# EAGLE design Regulator (EAGLE 9.6.2)
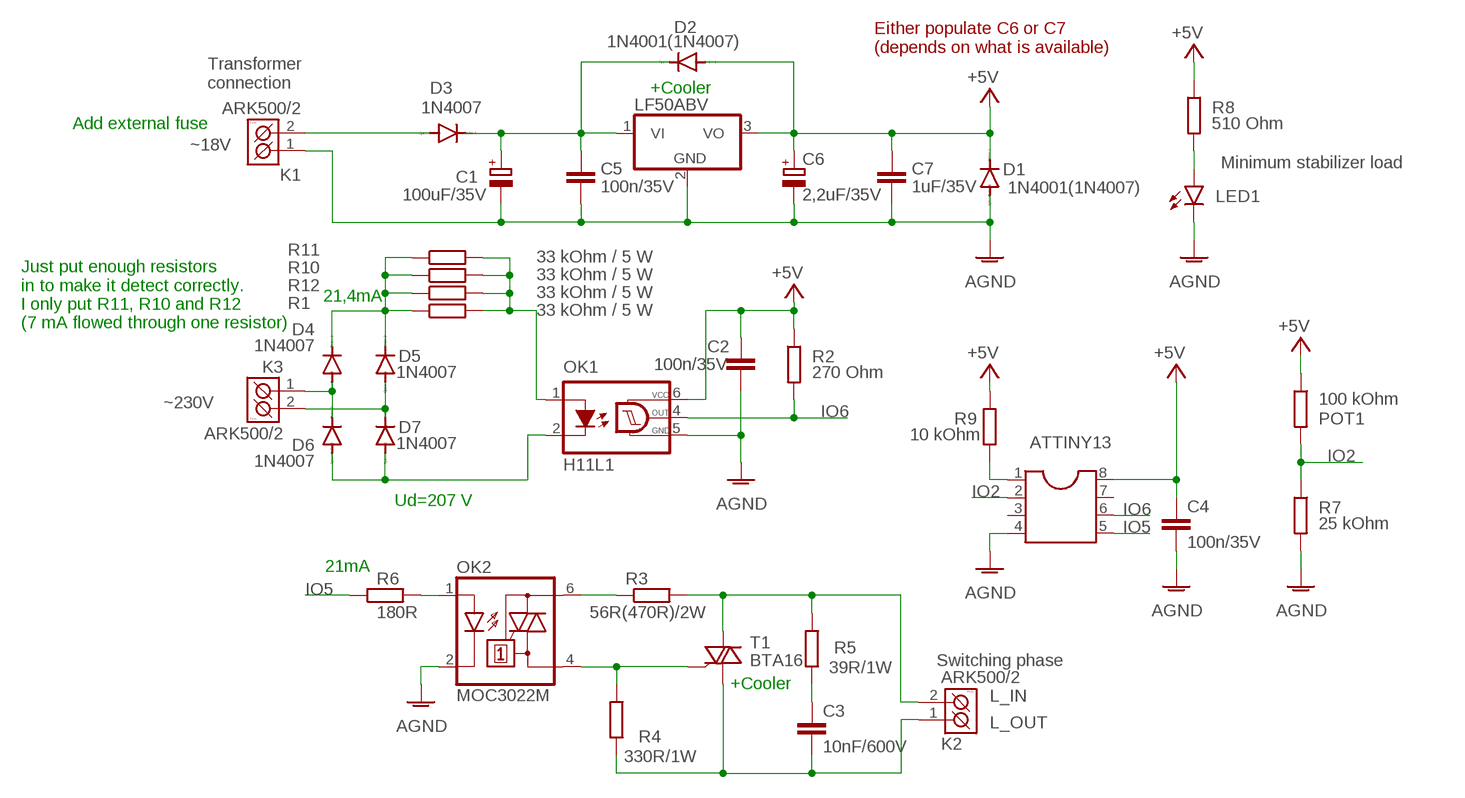
[diagram p0: schematic, sheet 1]

## Parts
ATTINY13  DIL8S  [SOCKET-08]
C1  100uF/35V  CPOL-EUE3.5-8  [E3,5-8]
C2  100n/35V  C-EU050-025X075  [C050-025X075]
C3  10nF/600V  C-EU025-030X050  [C025-030X050]
C4  100n/35V  C-EU050-025X075  [C050-025X075]
C5  100n/35V  C-EU050-025X075  [C050-025X075]
C6  2,2uF/35V  CPOL-EUE2-4  [E2-4]
C7  1uF/35V  C-EU050-025X075  [C050-025X075]
D1  1N4001(1N4007)  DIODE-DO41-7.6  [DO41-7.6]
D2  1N4001(1N4007)  DIODE-DO41-7.6  [DO41-7.6]
D3  1N4007  DIODE-DO41-7.6  [DO41-7.6]
D4  1N4007  DIODE-DO41-7.6  [DO41-7.6]
D5  1N4007  DIODE-DO41-7.6  [DO41-7.6]
D6  1N4007  DIODE-DO41-7.6  [DO41-7.6]
D7  1N4007  DIODE-DO41-7.6  [DO41-7.6]
K1  ARK500/2  [ARK500/2]
K2  ARK500/2  [ARK500/2]
K3  ARK500/2  [ARK500/2]
LED1  LED5MM  [LED5MM]
OK1  H11L1  H11L1M  [DIL06]
OK2  MOC3022M  [DIL06]
POT1  100 kOhm  R-EU_0207/10  [0207/10]
R1  33 kOhm / 5 W  R-EU_0617/5V  [0617V]
R2  270 Ohm  R-EU_0207/10  [0207/10]
R3  56R(470R)/2W  R-EU_0411/15  [0411/15]
R4  330R/1W  R-EU_0411/15  [0411/15]
R5  39R/1W  R-EU_0411/15  [0411/15]
R6  180R  R-EU_0207/10  [0207/10]
R7  25 kOhm  R-EU_0207/10  [0207/10]
R8  510 Ohm  R-EU_0207/10  [0207/10]
R9  10 kOhm  R-EU_0207/10  [0207/10]
R10  33 kOhm / 5 W  R-EU_0617/5V  [0617V]
R11  33 kOhm / 5 W  R-EU_0617/5V  [0617V]
R12  33 kOhm / 5 W  R-EU_0617/5V  [0617V]
ST1  LF50ABV  7805TV  [TO220V]
T1  BTA16  BT138-V  [TO220BV]

## Nets
+5V: ATTINY13.8 C2.1 C4.1 C6.+ C7.1 D1.C D2.A OK1.6(VCC) POT1.1 R2.1 R8.1 R9.1 ST1.3(VO)
AGND: ATTINY13.4 C1.- C2.2 C4.2 C5.2 C6.- C7.2 D1.A K1.1(K1) LED1.K(C) OK1.5(GND) OK2.2(C) R7.2 ST1.2(GND)
IO2: ATTINY13.2 POT1.2 R7.1
IO5: ATTINY13.5 R6.1
IO6: ATTINY13.6 OK1.4(OUT) R2.2
L_IN: K2.2(K2) R3.2 R5.2 T1.T2(A2)
L_OUT: C3.2 K2.1(K1) R4.1 T1.T1(A1)
N$1: OK1.1(A) R1.2 R10.2 R11.2 R12.2
N$2: D4.A D6.C K3.1(K1)
N$3: LED1.A R8.2
N$4: D3.A K1.2(K2)
N$5: OK2.6(A2) R3.1
N$6: D6.A D7.A OK1.2(C)
N$7: D5.A D7.C K3.2(K2)
N$8: C1.+ C5.1 D2.C D3.C ST1.1(VI)
N$9: OK2.1(A) R6.2
N$10: C3.1 R5.1
N$11: OK2.4(A1) R4.2 T1.G
N$12: ATTINY13.1 R9.2
N$14: D4.C D5.C R1.1 R10.1 R11.1 R12.1
Unconnected: ATTINY13.3 ATTINY13.7

## Notes on the sheet
- Either populate C6 or C7
  (depends on what is available)
- Transformer 
  connection
- +Cooler
- Add external fuse
- ~18V
- Minimum stabilizer load
- 21,4mA
- Just put enough resistors 
  in to make it detect correctly. 
  I only put R11, R10 and R12
  (7 mA flowed through one resistor)
- ~230V
- Ud=207 V
- 21mA
- Switching phase
- +Cooler
- L_IN
- L_OUT

## Library data of the parts
ATTINY13 = ic-package:DIL8: Dual In Line / Socket
C1 C6 = rcl:CPOL-EU: POLARIZED CAPACITOR, European symbol; SPICEPREFIX: C
C2-C5 C7 = rcl:C-EU: CAPACITOR, European symbol; SPICEPREFIX: C
D1-D7 = diode:DIODE-: DIODE
K1-K3 = #PaJa_konektory:ARK500/2: Svorkovnice - roztec 5mm - dvojita
LED1 = led:LED: LED OSRAM: - CHIPLED LG R971, LG N971, LY N971, LG Q971, LY Q971, LO R971, LY R971 LH N974, LH R974 LS Q976, LO Q976, LY Q976 LO Q996 - Hyper CHIPLED LW Q18S LB Q993, LB Q99A, LB R99A - SideLED LS A670, LO A670, LY A670, LG A670, LP A670 LB A673, LV A673, LT A673, LW A673 LH A674 LY A675 LS A676, LA A676, LO A676, LY A676, LW A676 LS A679, LY A679, LG A679 - Hyper Micro SIDELED® LS Y876, LA Y876, LO Y876, LY Y876 LT Y87S - SmartLED LW L88C, LW L88S LB L89C, LB L89S, LG L890 LS L89K, LO L89K, LY L89K LS L896, LA L896, LO L896, LY L896 - TOPLED LS T670, LO T670, LY T670, LG T670, LP T670 LSG T670, LSP T670, LSY T670, LOP T670, LYG T670 LG T671, LOG T671, LSG T671 LB T673, LV T673, LT T673, LW T673 LH T674 LS T676, LA T676, LO T676, LY T676, LB T676, LH T676, LSB T676, LW T676 LB T67C, LV T67C, LT T67C, LS T67K, LO T67K, LY T67K, LW E67C LS E67B, LA E67B, LO E67B, LY E67B, LB E67C, LV E67C, LT E67C LW T67C LS T679, LY T679, LG T679 LS T770, LO T770, LY T770, LG T770, LP T770 LB T773, LV T773, LT T773, LW T773 LH T774 LS E675, LA E675, LY E675, LS T675 LS T776, LA T776, LO T776, LY T776, LB T776 LHGB T686 LT T68C, LB T68C - Hyper Mini TOPLED® LB M676 - Mini TOPLED Santana® LG M470 LS M47K, LO M47K, LY M47K Source: http://www.osram.convergy.de LUXEON: - LUMILED® LXK2-PW12-R00, LXK2-PW12-S00, LXK2-PW14-U00, LXK2-PW14-V00 LXK2-PM12-R00, LXK2-PM12-S00, LXK2-PM14-U00 LXK2-PE12-Q00, LXK2-PE12-R00, LXK2-PE12-S00, LXK2-PE14-T00, LXK2-PE14-U00 LXK2-PB12-K00, LXK2-PB12-L00, LXK2-PB12-M00, LXK2-PB14-N00, LXK2-PB14-P00, LXK2-PB14-Q00 LXK2-PR12-L00, LXK2-PR12-M00, LXK2-PR14-Q00, LXK2-PR14-R00 LXK2-PD12-Q00, LXK2-PD12-R00, LXK2-PD12-S00 LXK2-PH12-R00, LXK2-PH12-S00 LXK2-PL12-P00, LXK2-PL12-Q00, LXK2-PL12-R00 Source: www.luxeon.com KINGBRIGHT: KA-3528ASYC Source: www.kingbright.com
OK1 = optocoupler:H11L*M: 6-Pin DIP Optocoupler Source: http://www.fairchildsemi.com/ds/H1/H11L2-M.pdf; MF: FAIRCHILD SEMICONDUCTOR; MPN: H11L1-M; OC_FARNELL: 1021127; OC_NEWARK: 72K8643
OK2 = optocoupler:MOC30*M: RANDOM-PHASE OPTOISOLATORS TRIAC DRIVER OUTPUT Source: http://www.fairchildsemi.com MOC3020-M.pdf; MF: FAIRCHILD SEMICONDUCTOR; MPN: MOC3022-M; OC_FARNELL: 1021086; OC_NEWARK: 58K1956
POT1 R1-R12 = rcl:R-EU_: RESISTOR, European symbol; SPICEPREFIX: R
ST1 = linear:78*: Positive VOLTAGE REGULATOR Source: http://cache.national.com/ds/LM/LM78L05.pdf http://www.fairchildsemi.com/ds/LM/LM7805.pdf
T1 = triac:BT138: TRIAC Source: http://www.semiconductors.philips.com BT138_SERIES_2.pdf

## Board
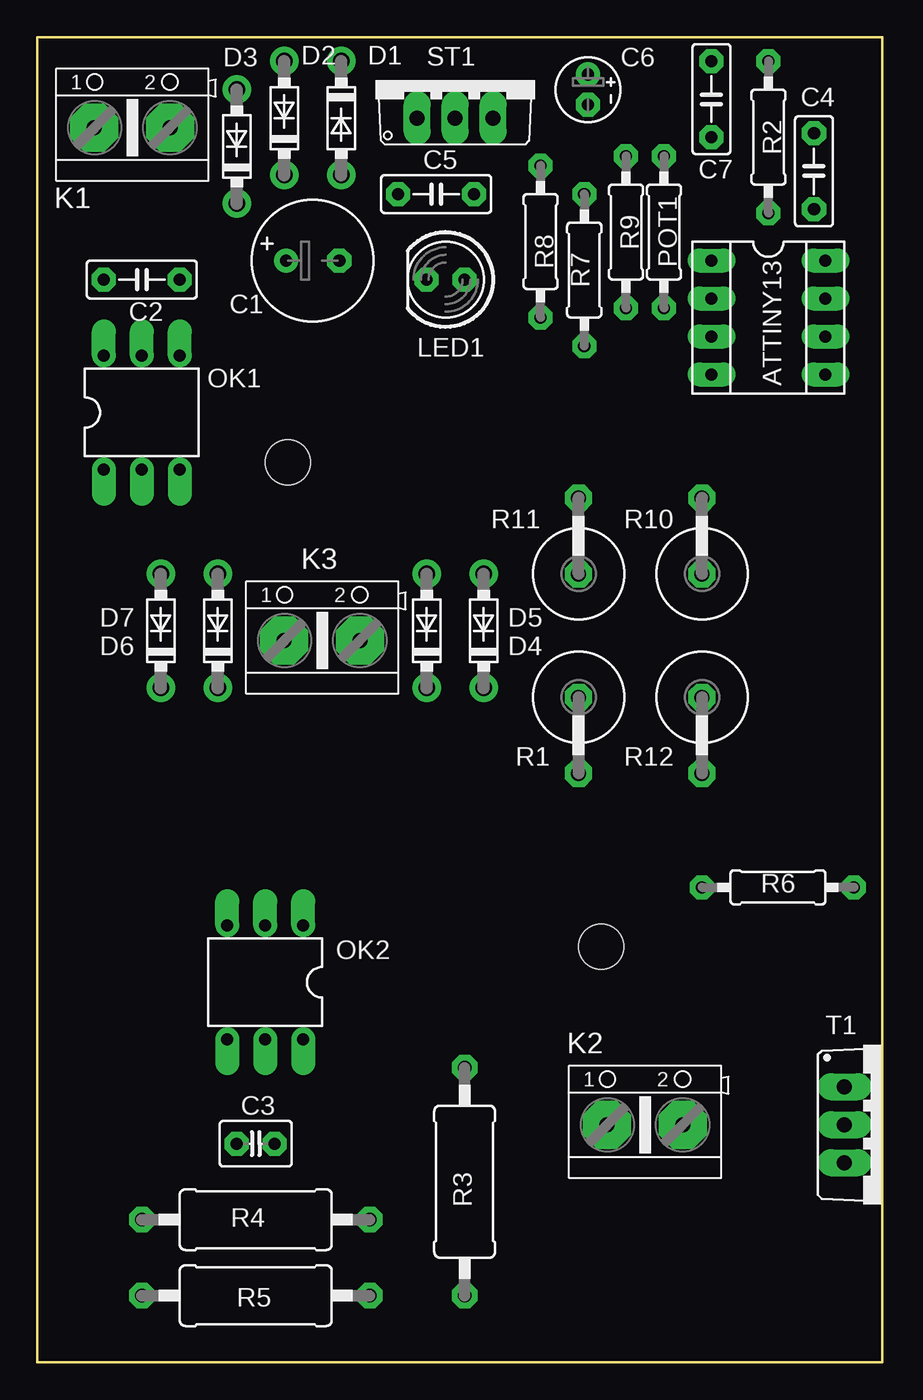
[diagram p1: board, top side]
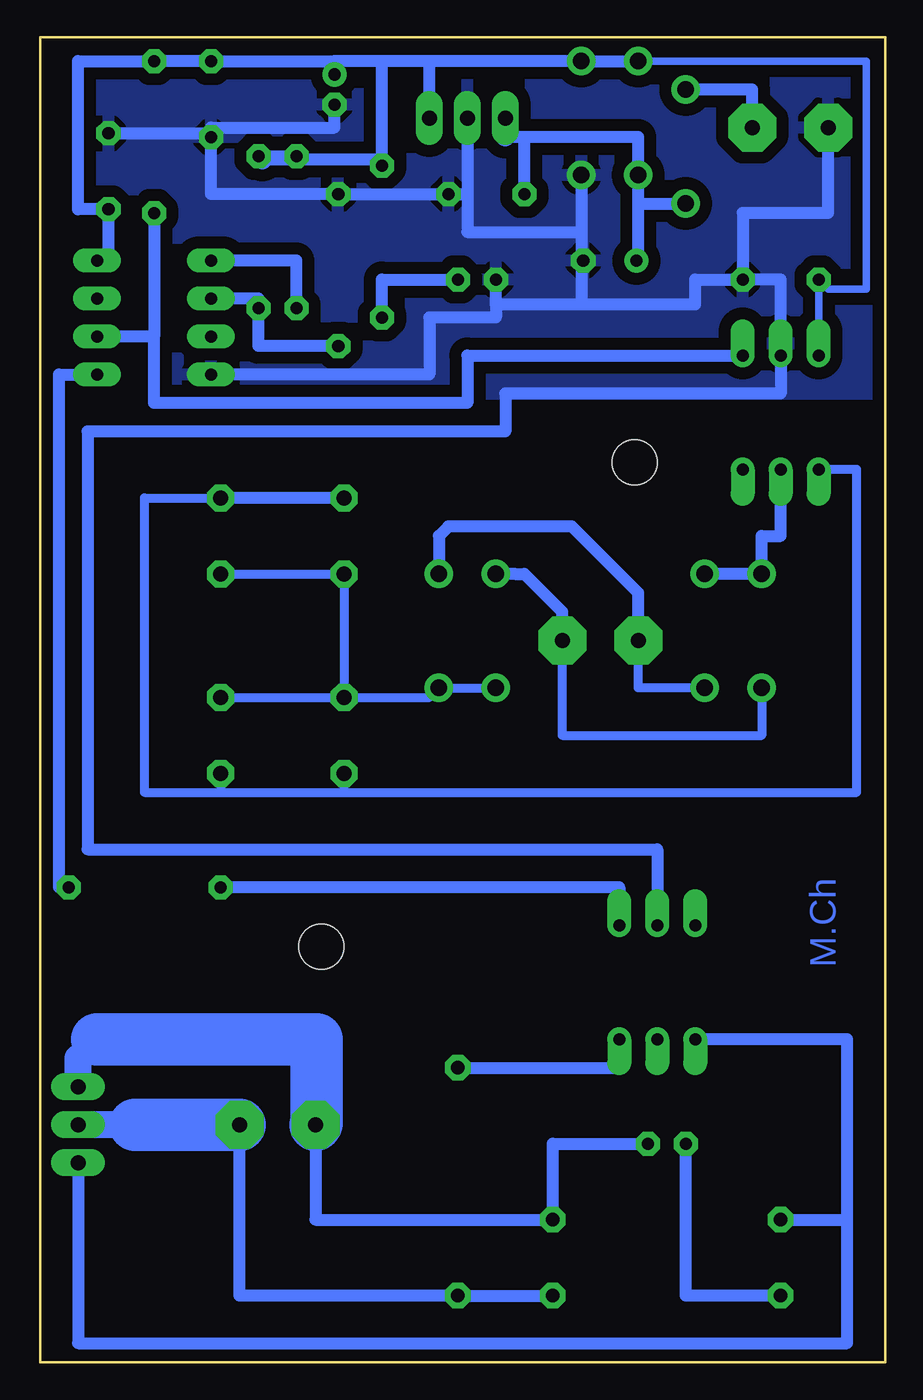
[diagram p2: board, bottom side, seen from below]

Size 56.52 x 88.58 mm. Coordinates in mm from the lower left corner, seen from the top.
Outline: 0,0 56.52,0 56.52,88.58 0,88.58 0,0
Copper layers (1*16): Top 0.035mm / dielectric 1.5mm / Bottom 0.035mm
Design rules "2 vrstvy trida 3": minimum track width 0.4mm, minimum drill 0.8mm, track to track 0.4mm, track to pad 0.4mm, pad to pad 0.4mm, via to via 0.4mm, smd to smd 0.4mm, copper to edge 0.5mm, drill to drill 0.8mm, minimum pad ring 0.4mm, minimum via ring 0.4mm, stop-mask expansion 0.15mm, vias tented up to drill 3mm, thermal gap 0.4mm
Holes 3 mm at 37.7,27.77 16.75,60.16

### Footprints (pad centres in the part's own frame; a part is rotated, then mirrored left to right if it is on the bottom)
SOCKET-08 = drill 0.813 long: 1 -3.81,-3.81; 2 -1.27,-3.81; 3 1.27,-3.81; 4 3.81,-3.81; 5 3.81,3.81; 6 1.27,3.81; 7 -1.27,3.81; 8 -3.81,3.81
E3,5-8 = drill 0.813 pad 1.6: + -1.778,0 | drill 0.813 pad 1.6 octagon: - 1.778,0
C050-025X075 = drill 0.813 octagon: 1 -2.54,0; 2 2.54,0
C025-030X050 = drill 0.813 octagon: 1 -1.27,0; 2 1.27,0
E2-4 = drill 0.813 pad 1.27: + -1.016,0 | drill 0.813 pad 1.27 octagon: - 1.016,0
DO41-7.6 = drill 1.1 pad 1.7: A 3.81,0; C -3.81,0
ARK500/2 = drill 1 pad 3.2 octagon: 1 -2.54,0; 2 2.54,0
LED5MM = drill 0.813 octagon: A -1.27,0; K 1.27,0
DIL06 = drill 0.813 offset: 1 -2.54,-3.81; 2 0,-3.81; 3 2.54,-3.81; 4 2.54,3.81; 5 0,3.81; 6 -2.54,3.81
0207/10 = drill 0.813 octagon: 1 -5.08,0; 2 5.08,0
0617V = drill 1.016 octagon: 1 -2.54,0; 2 2.54,0
0411/15 = drill 0.914 octagon: 1 -7.62,0; 2 7.62,0
TO220V = drill 1.016 long: 1 -2.54,-2.54; 2 0,-2.54; 3 2.54,-2.54
TO220BV = drill 1.016 long: G 2.54,-2.54; T1 -2.54,-2.54; T2 0,-2.54

### Placement (x,y rotation side)
ATTINY13  48.9,69.85 270 top
C1  18.41,73.66 0 top
C2  6.99,72.39 0 top
C3  14.61,14.61 0 top
C4  51.94,79.63 90 top
C5  26.67,78.11 0 top
C6  36.83,85.09 270 top
C7  45.09,84.45 270 top
D1  20.32,83.19 270 top
D2  16.51,83.19 90 top
D3  13.34,81.28 90 top
D4  29.84,48.9 90 top
D5  26.04,48.9 90 top
D6  12.06,48.9 90 top
D7  8.26,48.9 90 top
K1  6.35,82.55 0 top
K2  40.64,15.88 0 top
K3  19.05,48.26 0 top
LED1  27.3,72.39 180 top
OK1  6.99,63.5 0 top
OK2  15.24,25.4 180 top
POT1  41.91,75.56 270 top
R1  36.2,41.91 270 top
R2  48.9,81.92 270 top
R3  28.57,12.06 270 top
R4  14.61,9.53 180 top
R5  14.61,4.45 0 top
R6  49.53,31.75 180 top
R7  36.58,73.03 90 top
R8  33.66,74.93 270 top
R9  39.37,75.56 270 top
R10  44.45,55.24 90 top
R11  36.2,55.24 90 top
R12  44.45,41.91 270 top
ST1  27.94,85.72 0 top
T1  56.52,15.88 270 top

### Tracks (layer width: path | path; a pad name or v marks a point on that pad's centre or on a via)
+5V
  Bottom 0.508: OK1.6 C2.1 3.81,71.75 1.27,71.75 1.27,87 D2.A
  Bottom 0.813: 30.48,87 33.66,87 | 33.66,87 36.83,87 | ST1.3 30.48,87 | 36.83,87 C7.1 R2.1 53.98,87 53.98,77.09 C4.1 51.94,73.66 ATTINY13.8 | C6.+ 36.83,87 | 30.48,87 D1.C D2.A | 41.66,80.39 34.04,80.39 R8.1 33.66,87 | POT1.1 R9.1
  Bottom 1.27: 41.66,80.39 POT1.1
AGND
  Bottom 0.813: C6.- 36.83,82.55 45.09,82.55 C7.2 | K1.1 3.81,76.83 9.53,76.83 C2.2 | ATTINY13.4 30.48,66.04 30.48,69.85 26.04,69.85 26.04,70.74 | 26.04,70.74 LED1.K | C2.2 6.99,72.39 OK1.5 6.99,64.77 25.4,64.77 25.4,62.23 53.34,62.23 53.34,34.29 15.24,34.29 OK2.2 | 26.04,70.74 20.32,70.74 | C1.- 20.32,73.66 | 20.32,73.66 20.32,70.74 | D1.A 20.32,75.56 | 20.32,75.56 20.32,73.66 | 20.32,75.56 27.94,75.56 27.94,78.11 | ST1.2 27.94,78.11 | 27.94,78.11 C5.2 R7.2 45.09,78.11 C7.2 | 20.32,70.74 12.7,70.74 12.7,72.39 C2.2 | C4.2 45.09,82.17 C7.2
  pour Bottom (isolate 0.8): 56.52,64.77 0,64.77 0,88.58 56.52,88.58
IO2
  Bottom 0.813: ATTINY13.2 41.91,71.12 POT1.2 41.91,67.94 R7.1
IO5
  Bottom 0.813: ATTINY13.5 55.24,66.04 55.24,31.75 R6.1
IO6
  Bottom 0.813: R2.2 48.9,68.58 | 48.9,68.58 48.9,64.14 27.94,64.14 27.94,67.31 OK1.4 | 48.9,68.58 ATTINY13.6
L_IN
  Bottom 0.813: R5.2 R3.2 43.18,4.45 K2.2
  Bottom 1.8: 50.16,15.88 T1.T2
  Bottom 3.5: K2.2 50.16,15.88
L_OUT
  Bottom 0.813: C3.2 22.23,14.61 R4.1 38.1,9.53 K2.1
  Bottom 1.8: T1.T1 53.98,20.32 52.7,21.59
  Bottom 3.5: K2.1 38.01,15.96 38.01,21.59 52.7,21.59
N$1
  Bottom 0.61: R12.2 44.45,38.1 | 44.45,38.1 36.2,38.1 | 36.2,38.1 R1.2 | 36.2,38.1 1.91,38.1 1.91,59.69 OK1.1 | 44.45,38.1 49.53,38.1 49.53,57.78 R10.2
  Bottom 0.813: R11.2 R10.2
N$2
  Bottom 0.61: D6.C 16.51,45.09 K3.1
  Bottom 0.813: K3.1 16.51,51.44 20.95,55.88 29.21,55.88 29.84,55.24 D4.A
N$3
  Bottom 0.813: R8.2 33.66,72.39 LED1.A
N$4
  Bottom 0.813: K1.2 8.89,85.09 D3.A
N$5
  Bottom 0.813: R3.1 17.78,19.68 OK2.6
N$6
  Bottom 0.813: OK1.2 6.99,55.24 8.26,55.24 D7.A D6.A
N$7
  Bottom 0.61: D7.C 8.26,41.91 21.59,41.91 K3.2
  Bottom 0.813: K3.2 21.59,50.16 24.13,52.7 24.77,52.7 D5.A
N$8
  Bottom 0.813: D2.C 16.51,81.92 24.13,81.92 | D2.C 16.51,74.93 16.51,73.96 16.51,73.79 C1.+ | 24.13,81.92 25.4,81.92 | C5.1 24.13,81.92 | D3.C 16.51,77.47 D2.C
  Bottom 1.27: 25.4,81.92 ST1.1
N$9
  Bottom 0.813: OK2.1 17.78,31.75 R6.2
N$10
  Bottom 0.813: C3.1 13.34,4.45 R5.1
N$11
  Bottom 0.813: T1.G 53.98,1.27 2.54,1.27 2.54,9.53 | OK2.4 2.54,21.59 2.54,9.53 | R4.2 2.54,9.53
N$12
  Bottom 0.813: ATTINY13.1 39.37,73.66 R9.2
N$14
  Bottom 0.61: R10.1 R11.1 R1.1 | R12.1 R1.1 | D5.C D4.C 30.48,44.45 R1.1

### Text on the board
Bottom: M.Ch
tDocu: ~ 18 V | Transformer | AC | L_OUT | L_IN | Switched phase